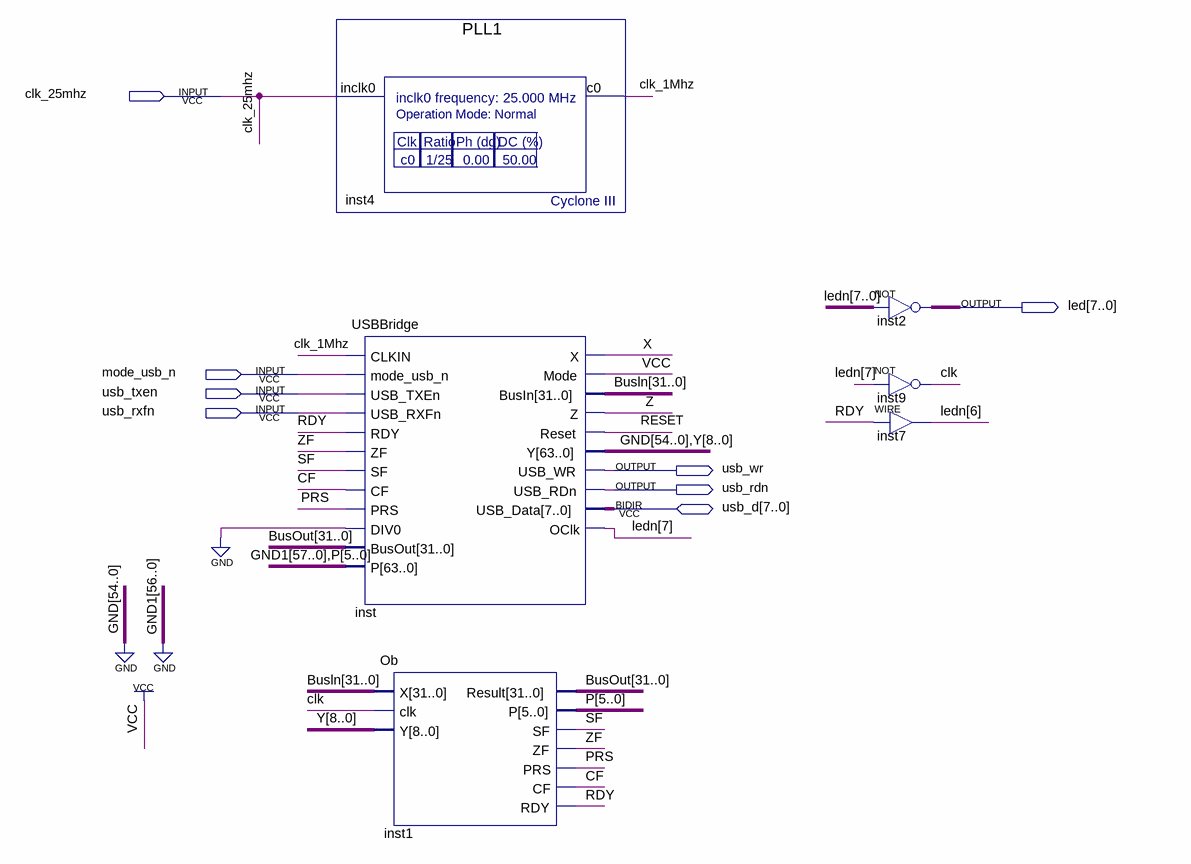
[diagram p0: schematic sheet]
// Quartus schematic ALUUAPR.bdf as structural Verilog: 6 symbols, 8 pins
module ALUUAPR (
  input  clk_25mhz,
  input  mode_usb_n,
  input  usb_txen,
  input  usb_rxfn,
  inout  [7:0] usb_d,
  output [7:0] led,
  output usb_wr,
  output usb_rdn
);

  wire CF, clk, clk_1Mhz, PRS, RDY, RESET, SF, VCC, X, Z, ZF;
  wire [5:0] P;
  wire [7:0] ledn;
  wire [8:0] Y;
  wire [31:0] Busln, BusOut;
  wire [54:0] GND;
  wire [57:57] GND1;

  PLL1 inst4 (.inclk0(clk_25mhz), .c0(clk_1Mhz));
  USBBridge inst (
    .CLKIN(clk_1Mhz), .mode_usb_n(mode_usb_n), .USB_TXEn(usb_txen), .USB_RXFn(usb_rxfn), .RDY(RDY), .ZF(ZF),
    .SF(SF), .CF(CF), .PRS(PRS), .DIV0(1'b0), .BusOut(BusOut), .P({GND1[57], {57{1'b0}}, P}), .X(X),
    .Mode(VCC), .BusIn(Busln), .Z(Z), .Reset(RESET), .Y({GND, Y}), .USB_WR(usb_wr), .USB_RDn(usb_rdn),
    .OClk(ledn[7]), .USB_Data(usb_d));
  Ob inst1 (.X(Busln), .clk(clk), .Y(Y), .Result(BusOut), .P(P), .SF(SF), .ZF(ZF), .PRS(PRS), .CF(CF), .RDY(RDY));
  assign led = ~ledn;  // NOT inst2, 8 bits wide
  not inst9 (clk, ledn[7]);
  assign ledn[6] = RDY;  // WIRE inst7
  // also tied to GND on the sheet: {GND[0], GND[1], GND[2], GND[3], GND[4], GND[5], GND[6], GND[7], GND[8], GND[9], GND[10], GND[11], GND[12], GND[13], GND[14], GND[15], GND[16], GND[17], GND[18], GND[19], GND[20], GND[21], GND[22], GND[23], GND[24], GND[25], GND[26], GND[27], GND[28], GND[29], GND[30], GND[31], GND[32], GND[33], GND[34], GND[35], GND[36], GND[37], GND[38], GND[39], GND[40], GND[41], GND[42], GND[43], GND[44], GND[45], GND[46], GND[47], GND[48], GND[49], GND[50], GND[51], GND[52], GND[53], GND[54]}
  // also tied to VCC on the sheet: VCC
endmodule
